# EAGLE design netuno (EAGLE 7.3.0)
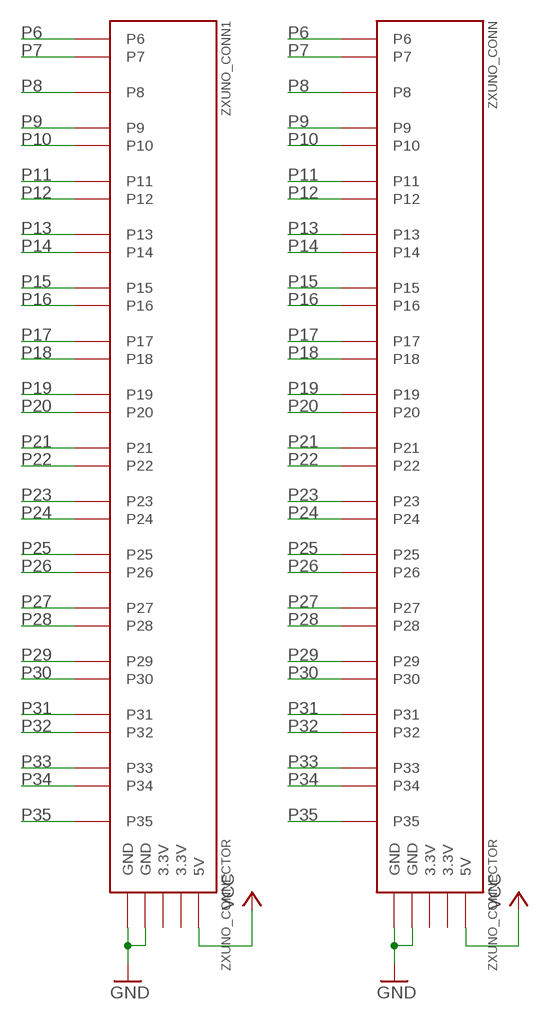
[diagram p0: schematic, sheet 1]

## Parts
ZXUNO_CONN  ZXUNO_CONNECTOR  [ZXUNO_CONNECTOR]
ZXUNO_CONN1  ZXUNO_CONNECTOR  [ZXUNO_CONNECTOR]

## Nets
GND: ZXUNO_CONN1.GND@1(GND) ZXUNO_CONN1.GND@2(GND) ZXUNO_CONN.GND@1(GND) ZXUNO_CONN.GND@2(GND)
P6: ZXUNO_CONN1.P6 ZXUNO_CONN.P6
P7: ZXUNO_CONN1.P7 ZXUNO_CONN.P7
P8: ZXUNO_CONN1.P8 ZXUNO_CONN.P8
P9: ZXUNO_CONN1.P9 ZXUNO_CONN.P9
P10: ZXUNO_CONN1.P10 ZXUNO_CONN.P10
P11: ZXUNO_CONN1.P11 ZXUNO_CONN.P11
P12: ZXUNO_CONN1.P12 ZXUNO_CONN.P12
P13: ZXUNO_CONN1.P13 ZXUNO_CONN.P13
P14: ZXUNO_CONN1.P14 ZXUNO_CONN.P14
P15: ZXUNO_CONN1.P15 ZXUNO_CONN.P15
P16: ZXUNO_CONN1.P16 ZXUNO_CONN.P16
P17: ZXUNO_CONN1.P17 ZXUNO_CONN.P17
P18: ZXUNO_CONN1.P18 ZXUNO_CONN.P18
P19: ZXUNO_CONN1.P19 ZXUNO_CONN.P19
P20: ZXUNO_CONN1.P20 ZXUNO_CONN.P20
P21: ZXUNO_CONN1.P21 ZXUNO_CONN.P21
P22: ZXUNO_CONN1.P22 ZXUNO_CONN.P22
P23: ZXUNO_CONN1.P23 ZXUNO_CONN.P23
P24: ZXUNO_CONN1.P24 ZXUNO_CONN.P24
P25: ZXUNO_CONN1.P25 ZXUNO_CONN.P25
P26: ZXUNO_CONN1.P26 ZXUNO_CONN.P26
P27: ZXUNO_CONN1.P27 ZXUNO_CONN.P27
P28: ZXUNO_CONN1.P28 ZXUNO_CONN.P28
P29: ZXUNO_CONN1.P29 ZXUNO_CONN.P29
P30: ZXUNO_CONN1.P30 ZXUNO_CONN.P30
P31: ZXUNO_CONN1.P31 ZXUNO_CONN.P31
P32: ZXUNO_CONN1.P32 ZXUNO_CONN.P32
P33: ZXUNO_CONN1.P33 ZXUNO_CONN.P33
P34: ZXUNO_CONN1.P34 ZXUNO_CONN.P34
P35: ZXUNO_CONN1.P35 ZXUNO_CONN.P35
VCC: ZXUNO_CONN1.5V ZXUNO_CONN.5V
Unconnected: ZXUNO_CONN1.3.3V@1(3.3V) ZXUNO_CONN1.3.3V@2(3.3V) ZXUNO_CONN.3.3V@1(3.3V) ZXUNO_CONN.3.3V@2(3.3V)

## Library data of the parts
ZXUNO_CONN ZXUNO_CONN1 = zxuno:ZXUNO_CONNECTOR

## Net classes
0 default: width 0.178 mm, clearance 0.178 mm
1 power: width 0.305 mm, clearance 0.178 mm to class 0, clearance 0.229 mm

## Board
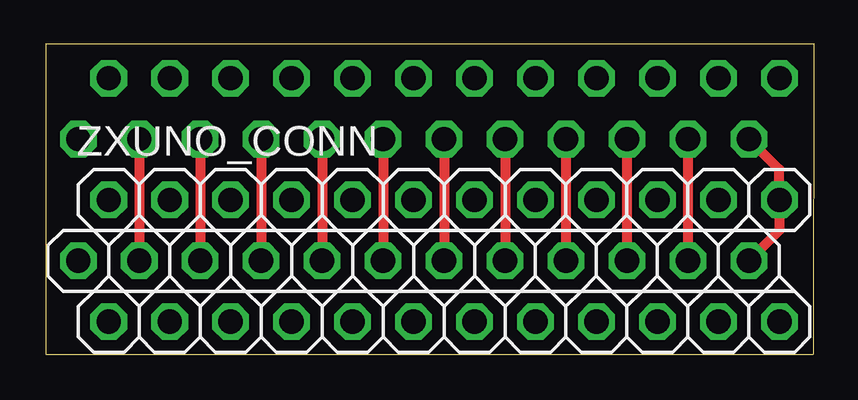
[diagram p1: board, top side]
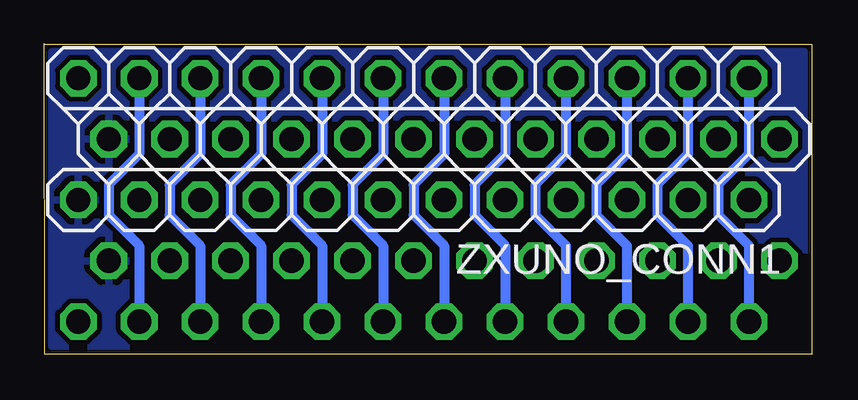
[diagram p2: board, bottom side, seen from below]

No outline drawn. Coordinates in mm, seen from the top.
Copper layers (1*16): Top 0.035mm / dielectric 1.5mm / Bottom 0.035mm
Design rules "default": minimum track width 10mil, minimum drill 24mil, track to track 8mil, track to pad 8mil, pad to pad 8mil, via to via 8mil, smd to smd 8mil, copper to edge 40mil, drill to drill 8mil, minimum pad ring 10mil, minimum via ring 8mil, stop-mask expansion 4mil, vias tented up to drill 0mil, thermal gap 10mil
Milling: 4 lines

### Footprints (pad centres in the part's own frame; a part is rotated, then mirrored left to right if it is on the bottom)
ZXUNO_CONNECTOR = drill 1.016 octagon: 3.3V@1 -13.97,0; 3.3V@2 15.24,-2.54; 5V -12.7,-2.54; GND@1 15.24,2.54; GND@2 13.97,0; NC@1 12.7,2.54; P6 -12.7,2.54; P7 -10.16,-2.54; P8 -11.43,0; P9 -10.16,2.54; P10 -7.62,-2.54; P11 -8.89,0; P12 -7.62,2.54; P13 -5.08,-2.54; P14 -6.35,0; P15 -5.08,2.54; P16 -2.54,-2.54; P17 -3.81,0; P18 -2.54,2.54; P19 0,-2.54; P20 -1.27,0; P21 0,2.54; P22 2.54,-2.54; P23 1.27,0; P24 2.54,2.54; P25 5.08,-2.54; P26 3.81,0; P27 5.08,2.54; P28 7.62,-2.54; P29 6.35,0; P30 7.62,2.54; P31 10.16,-2.54; P32 8.89,0; P33 10.16,2.54; P34 12.7,-2.54; P35 11.43,0

### Placement (x,y rotation side)
ZXUNO_CONN  15.32,3.89 0 top
ZXUNO_CONN1  15.32,8.97 180 bottom

### Tracks (layer width: path | path; a pad name or v marks a point on that pad's centre or on a via)
GND
  Top 0.406: ZXUNO_CONN1.GND@2 30.56,7.7 ZXUNO_CONN1.GND@1 30.56,5.16 ZXUNO_CONN.GND@2
  pour Bottom: 0.32,12.62 31.67,12.62 31.67,0.32 0.32,0.32
P7
  Bottom 0.406: ZXUNO_CONN1.P7 5.16,8.33 6.43,7.06 6.43,5.79 5.16,4.52 ZXUNO_CONN.P7
P8
  Top 0.406: ZXUNO_CONN1.P8 ZXUNO_CONN.P8
P10
  Bottom 0.406: ZXUNO_CONN1.P10 7.7,8.33 8.97,7.06 8.97,5.79 7.7,4.52 ZXUNO_CONN.P10
P11
  Top 0.406: ZXUNO_CONN1.P11 ZXUNO_CONN.P11
P13
  Bottom 0.406: ZXUNO_CONN1.P13 10.24,8.33 11.51,7.06 11.51,5.79 10.24,4.52 ZXUNO_CONN.P13
P14
  Top 0.406: ZXUNO_CONN1.P14 ZXUNO_CONN.P14
P16
  Bottom 0.406: ZXUNO_CONN1.P16 12.78,8.33 14.05,7.06 14.05,5.79 12.78,4.52 ZXUNO_CONN.P16
P17
  Top 0.406: ZXUNO_CONN1.P17 ZXUNO_CONN.P17
P19
  Bottom 0.406: ZXUNO_CONN1.P19 15.32,8.33 16.59,7.06 16.59,5.79 15.32,4.52 ZXUNO_CONN.P19
P20
  Top 0.406: ZXUNO_CONN1.P20 ZXUNO_CONN.P20
P22
  Bottom 0.406: ZXUNO_CONN1.P22 17.86,8.33 19.13,7.06 19.13,5.79 17.86,4.52 ZXUNO_CONN.P22
P23
  Top 0.406: ZXUNO_CONN1.P23 ZXUNO_CONN.P23
P25
  Bottom 0.406: ZXUNO_CONN1.P25 20.4,8.33 21.67,7.06 21.67,5.79 20.4,4.52 ZXUNO_CONN.P25
P26
  Top 0.406: ZXUNO_CONN1.P26 ZXUNO_CONN.P26
P28
  Bottom 0.406: ZXUNO_CONN1.P28 22.94,8.33 24.21,7.06 24.21,5.79 22.94,4.52 ZXUNO_CONN.P28
P29
  Top 0.406: ZXUNO_CONN1.P29 ZXUNO_CONN.P29
P31
  Bottom 0.406: ZXUNO_CONN1.P31 25.48,8.33 26.75,7.06 26.75,5.79 25.48,4.52 ZXUNO_CONN.P31
P32
  Top 0.406: ZXUNO_CONN1.P32 ZXUNO_CONN.P32
P34
  Bottom 0.406: ZXUNO_CONN1.P34 28.02,8.33 29.29,7.06 29.29,5.79 28.02,4.52 ZXUNO_CONN.P34
P35
  Top 0.406: ZXUNO_CONN1.P35 ZXUNO_CONN.P35
VCC
  Bottom 0.406: ZXUNO_CONN1.5V 2.62,8.33 3.89,7.06 3.89,5.79 2.62,4.52 ZXUNO_CONN.5V